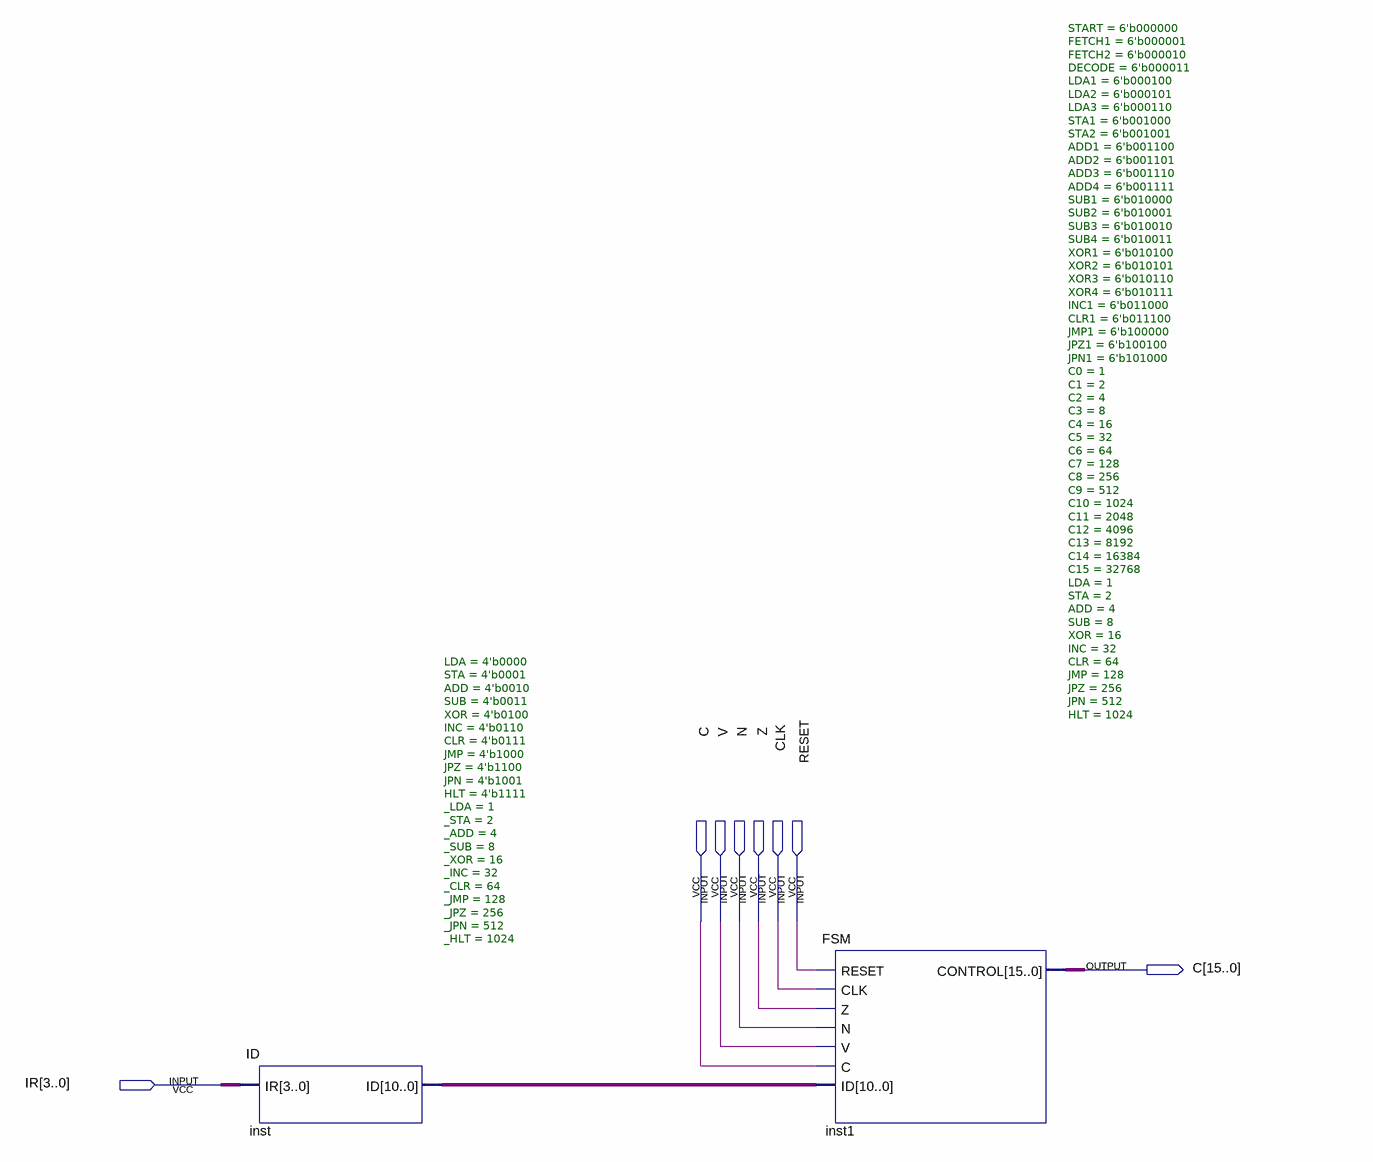
[diagram p0: schematic sheet]
// Quartus schematic CU.bdf as structural Verilog: 2 symbols, 8 pins
module CU (
  input  C_1bit,
  input  V,
  input  N,
  input  Z,
  input  CLK,
  input  RESET,
  input  [3:0] IR,
  output [15:0] C
);

  wire [10:0] inst_id;

  ID #(.LDA(4'b0000), .STA(4'b0001), .ADD(4'b0010), .SUB(4'b0011), .XOR(4'b0100), .INC(4'b0110), .CLR(4'b0111), .JMP(4'b1000), .JPZ(4'b1100), .JPN(4'b1001), .HLT(4'b1111), ._LDA(1), ._STA(2), ._ADD(4), ._SUB(8), ._XOR(16), ._INC(32), ._CLR(64), ._JMP(128), ._JPZ(256), ._JPN(512), ._HLT(1024)) inst (
    .IR(IR), .ID(inst_id));
  FSM #(.START(6'b000000), .FETCH1(6'b000001), .FETCH2(6'b000010), .DECODE(6'b000011), .LDA1(6'b000100), .LDA2(6'b000101), .LDA3(6'b000110), .STA1(6'b001000), .STA2(6'b001001), .ADD1(6'b001100), .ADD2(6'b001101), .ADD3(6'b001110), .ADD4(6'b001111), .SUB1(6'b010000), .SUB2(6'b010001), .SUB3(6'b010010), .SUB4(6'b010011), .XOR1(6'b010100), .XOR2(6'b010101), .XOR3(6'b010110), .XOR4(6'b010111), .INC1(6'b011000), .CLR1(6'b011100), .JMP1(6'b100000), .JPZ1(6'b100100), .JPN1(6'b101000), .C0(1), .C1(2), .C2(4), .C3(8), .C4(16), .C5(32), .C6(64), .C7(128), .C8(256), .C9(512), .C10(1024), .C11(2048), .C12(4096), .C13(8192), .C14(16384), .C15(32768), .LDA(1), .STA(2), .ADD(4), .SUB(8), .XOR(16), .INC(32), .CLR(64), .JMP(128), .JPZ(256), .JPN(512), .HLT(1024)) inst1 (
    .RESET(RESET), .CLK(CLK), .Z(Z), .N(N), .V(V), .C(C_1bit), .ID(inst_id), .CONTROL(C));
endmodule
